# Altium project SpaceLocator.PrjPCB
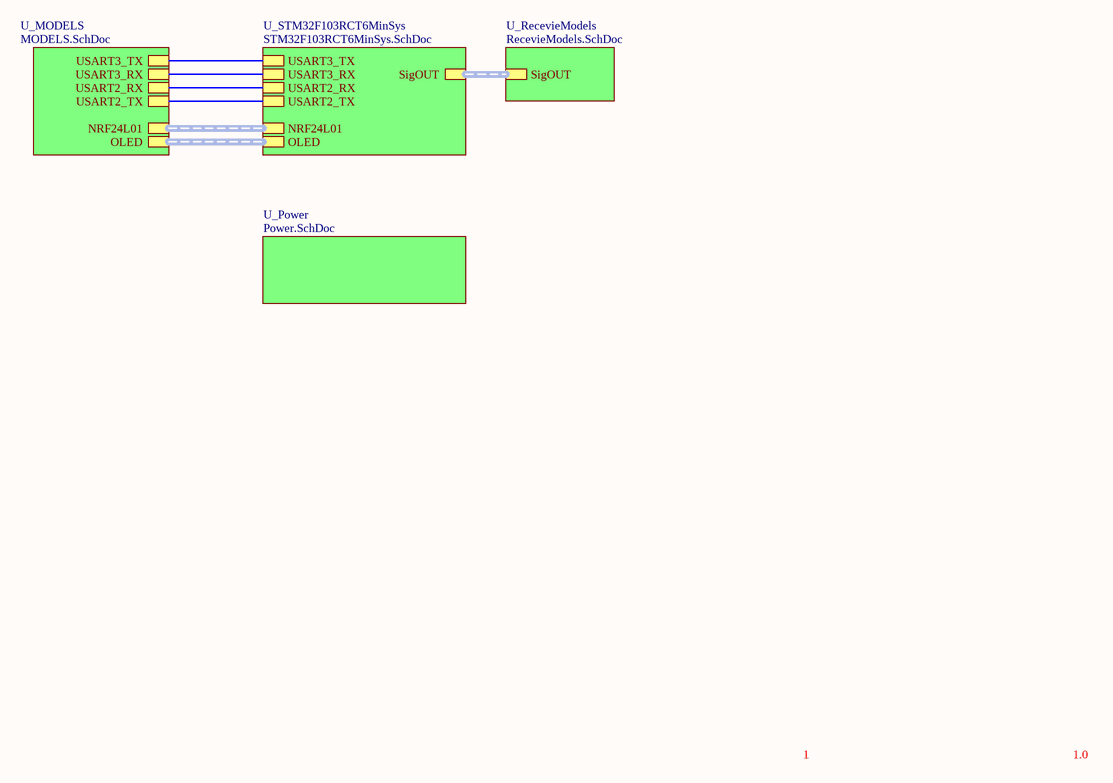
[diagram p0: MAIN.SchDoc]
5 sheets, 79 parts. Net scope: hierarchical (ports join the sheet entries above them; power ports are global).
Board file: SpaceLocator.PcbDoc
Sheets:
  MAIN.SchDoc
    U_MODELS = MODELS.SchDoc
    U_Power = Power.SchDoc
    U_RecevieModels = RecevieModels.SchDoc
    U_STM32F103RCT6MinSys = STM32F103RCT6MinSys.SchDoc

## Sheet MAIN.SchDoc: SpaceLocator
size A4; Author: 罗琪; Engineer: 罗琪

### Sub-sheets
U_MODELS = MODELS.SchDoc: NRF24L01 (harness NRF24L01), USART2_TX, USART2_RX, USART3_RX, USART3_TX, OLED (harness OLED)
U_Power = Power.SchDoc: no entries
U_RecevieModels = RecevieModels.SchDoc: SigOUT (harness SigOUT)
U_STM32F103RCT6MinSys = STM32F103RCT6MinSys.SchDoc: USART2_TX, USART2_RX, USART3_RX, USART3_TX, NRF24L01 (harness NRF24L01), SigOUT (harness SigOUT), OLED (harness OLED)

### Nets
NetU3_16: sheet U_MODELS/USART2_TX, sheet U_STM32F103RCT6MinSys/USART2_TX
NetU3_17: sheet U_MODELS/USART2_RX, sheet U_STM32F103RCT6MinSys/USART2_RX
NetU3_29: sheet U_MODELS/USART3_TX, sheet U_STM32F103RCT6MinSys/USART3_TX
NetU3_30: sheet U_MODELS/USART3_RX, sheet U_STM32F103RCT6MinSys/USART3_RX

### Buses and harness runs
harness sheet U_MODELS/NRF24L01 = sheet U_STM32F103RCT6MinSys/NRF24L01
harness sheet U_MODELS/OLED = sheet U_STM32F103RCT6MinSys/OLED
harness sheet U_RecevieModels/SigOUT = sheet U_STM32F103RCT6MinSys/SigOUT

### Notes on the sheet
- 1
- 1.0

## Sheet MODELS.SchDoc
size A4
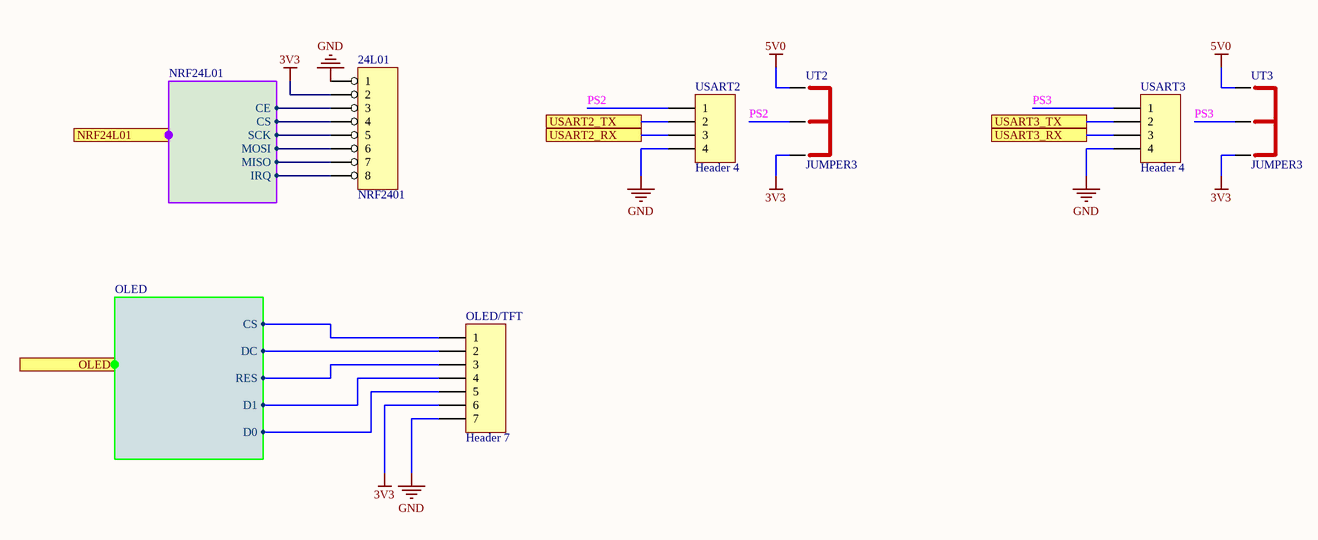
[diagram p1: MODELS.SchDoc]

### Parts
24L01  NRF2401  [HDR2X4]
OLED/TFT  Header 7  [HDR1X7]
USART2  Header 4  [HDR1X4]
USART3  Header 4  [HDR1X4]
UT2  JUMPER3  [Jumper3]
UT3  JUMPER3  [Jumper3]

### Ports
NRF24L01 (harness NRF24L01), OLED (harness OLED), USART2_RX, USART2_TX, USART3_RX, USART3_TX

### Harnesses
NRF24L01: CE, CS, SCK, MOSI, MISO, IRQ
OLED: D0, D1, RES, DC, CS

### Nets
3V3: 24L01.2 OLED/TFT.6 UT2.3 UT3.3
5V0: UT2.1 UT3.1
GND: 24L01.1 OLED/TFT.7 USART2.4 USART3.4
OLED_CS: OLED/TFT.1 ; port OLED.CS
OLED_D0: OLED/TFT.5 ; port OLED.D0
OLED_D1: OLED/TFT.4 ; port OLED.D1
OLED_DC: OLED/TFT.2 ; port OLED.DC
OLED_RES: OLED/TFT.3 ; port OLED.RES
PS2: USART2.1 UT2.2
PS3: USART3.1 UT3.2
Net24L01_3: 24L01.3 ; port NRF24L01.CE
Net24L01_4: 24L01.4 ; port NRF24L01.CS
Net24L01_5: 24L01.5 ; port NRF24L01.SCK
Net24L01_6: 24L01.6 ; port NRF24L01.MOSI
Net24L01_7: 24L01.7 ; port NRF24L01.MISO
Net24L01_8: 24L01.8 ; port NRF24L01.IRQ
NetU3_16: USART2.2 ; port USART2_TX
NetU3_17: USART2.3 ; port USART2_RX
NetU3_29: USART3.2 ; port USART3_TX
NetU3_30: USART3.3 ; port USART3_RX

### Library data of the parts
24L01 = HEADER 8: 8 Pin Header
OLED/TFT = Header 7: Header, 7-Pin; LatestRevisionDate: 17-Jul-2002; LatestRevisionNote: Re-released for DXP Platform.; Publisher: Altium Limited
USART2 USART3 = Header 4: Header, 4-Pin; LatestRevisionDate: 17-Jul-2002; LatestRevisionNote: Re-released for DXP Platform.; Publisher: Altium Limited
UT2 UT3 = JUMPER3: Jumper

## Sheet Power.SchDoc
size A4
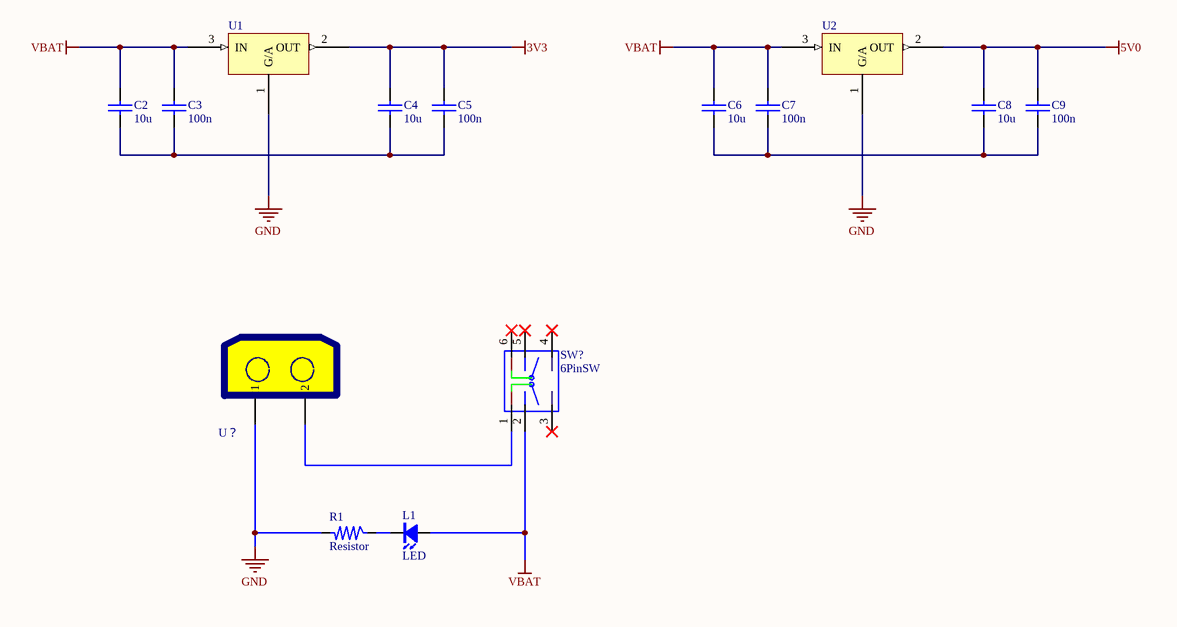
[diagram p2: Power.SchDoc]

### Parts
C2  10u  [C0805]
C3  100n  [C0603]
C4  10u  [C0805]
C5  100n  [C0603]
C6  10u  [C0805]
C7  100n  [C0603]
C8  10u  [C0805]
C9  100n  [C0603]
L1  LED  [LED0805TB]
R1  Resistor  [R0805]
SW?  6PinSW  [SW-7X7]
U1  AMS1117-XX  [SOT223]  (value not drawn)
U2  AMS1117-XX  [SOT223]  (value not drawn)
U？  P  [2脚接头]  (value not drawn)

### Nets
3V3: C4.1 C5.1 U1.2(OUT)
5V0: C8.1 C9.1 U2.2(OUT)
GND: R1.1 U1.1(G/A) U2.1(G/A) U？.1
VBAT: C2.1 C3.1 C6.1 C7.1 L1.1(A) SW?.2 U1.3(IN) U2.3(IN)
NetC2_2: C2.2 C3.2 C4.2 C5.2
NetC6_2: C6.2 C7.2 C8.2 C9.2
NetL1_2: L1.2(K) R1.2
NetSW?_1: SW?.1 U？.2

Not connected (* = marked no-connect by the designer): SW? 3(5)* 4(6)* 5(7)* 6(8)*

### Notes on the sheet
- Title
- Size:
- Date:
- A4
- Number:
- Time:
- Revision:
- Sheet
- of
- File:

### Library data of the parts
C2-C9 = Capacitor: 电容
R1 = Resistor: 电阻
U1 U2 = AMS1117-XX: 稳压芯片
U？ = 2脚接头

## Sheet RecevieModels.SchDoc
size A4
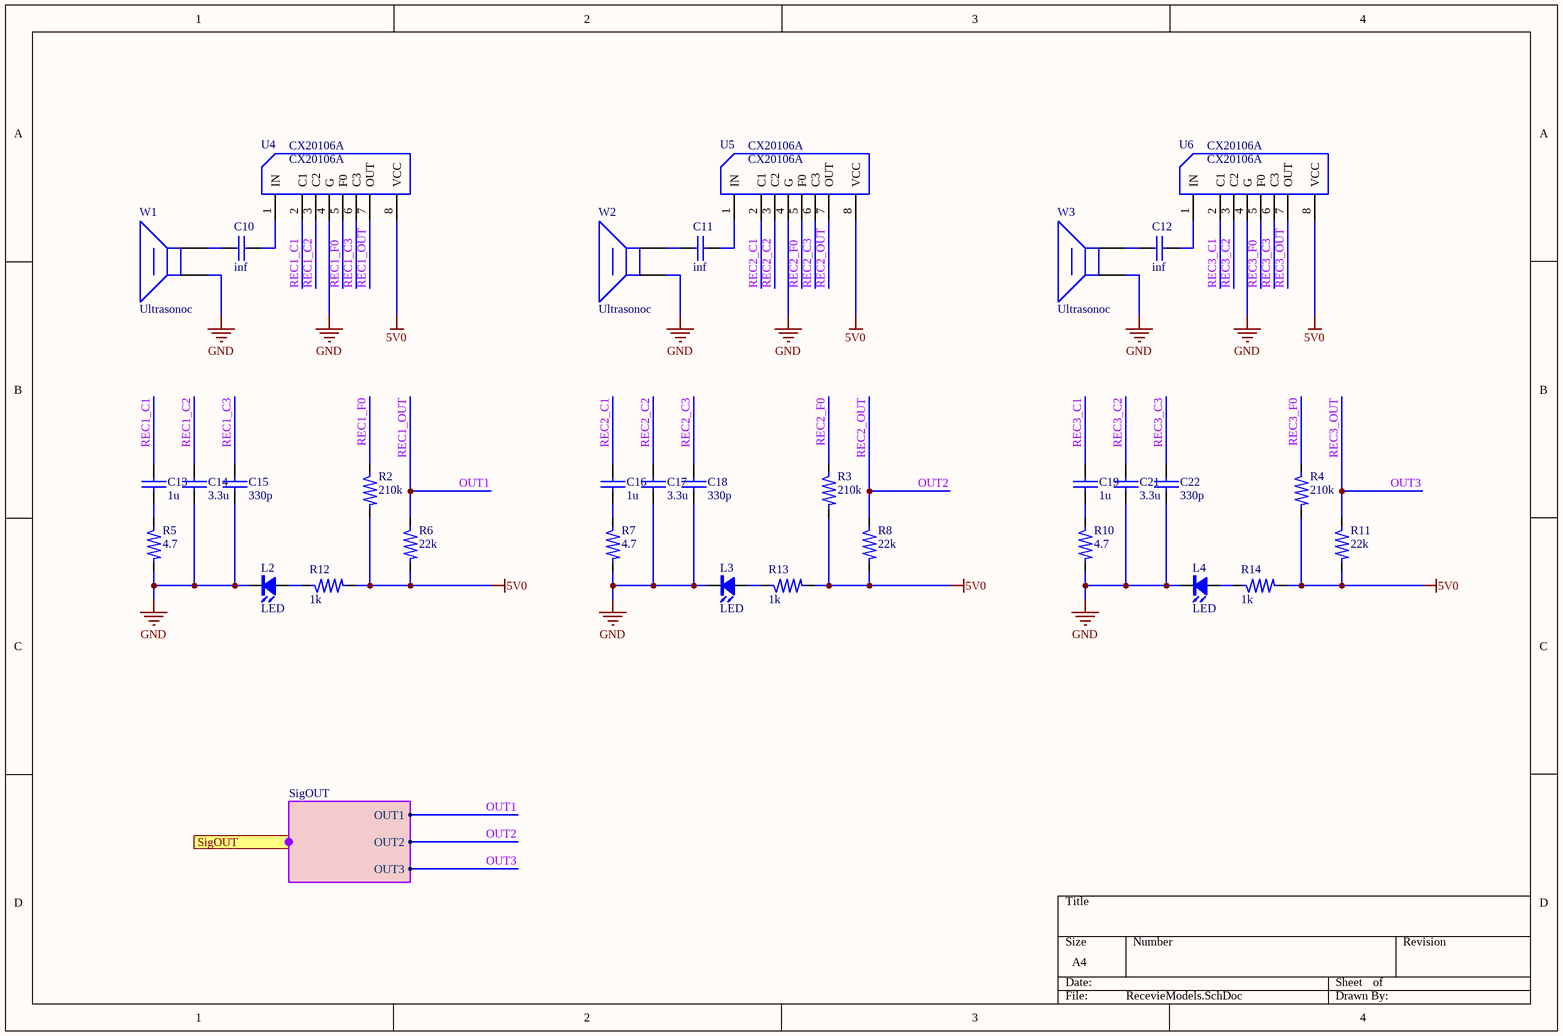
[diagram p3: RecevieModels.SchDoc]

### Parts
C10  inf  [C0603]
C11  inf  [C0603]
C12  inf  [C0603]
C13  1u  [C0603]
C14  3.3u  [C0603]
C15  330p  [C0603]
C16  1u  [C0603]
C17  3.3u  [C0603]
C18  330p  [C0603]
C19  1u  [C0603]
C21  3.3u  [C0603]
C22  330p  [C0603]
L2  LED  [LED0805TB]
L3  LED  [LED0805TB]
L4  LED  [LED0805TB]
R2  210k  [R0603]
R3  210k  [R0603]
R4  210k  [R0603]
R5  4.7  [R0603]
R6  22k  [R0603]
R7  4.7  [R0603]
R8  22k  [R0603]
R10  4.7  [R0603]
R11  22k  [R0603]
R12  1k  [R0603]
R13  1k  [R0603]
R14  1k  [R0603]
U4  CX20106A  [8Pin_100mil]
U5  CX20106A  [8Pin_100mil]
U6  CX20106A  [8Pin_100mil]
W1  Ultrasonoc  [Circle_1cm]
W2  Ultrasonoc  [Circle_1cm]
W3  Ultrasonoc  [Circle_1cm]

### Ports
SigOUT (harness SigOUT)

### Harnesses
SigOUT: OUT1, OUT2, OUT3

### Nets
5V0: R2.1 R3.1 R4.1 R6.1 R8.1 R11.1 R12.1 R13.1 R14.1 U4.8(VCC) U5.8(VCC) U6.8(VCC)
GND: C14.2 C15.2 C17.2 C18.2 C21.2 C22.2 L2.2(K) L3.2(K) L4.2(K) R5.1 R7.1 R10.1 U4.4(G) U5.4(G) U6.4(G) W1.1 W2.1 W3.1
OUT1: R6.2 U4.7(OUT) ; port SigOUT.OUT1  [also labelled REC1_OUT]  [project net EXTI0]
OUT2: R8.2 U5.7(OUT) ; port SigOUT.OUT2  [also labelled REC2_OUT]  [project net EXTI1]
OUT3: R11.2 U6.7(OUT) ; port SigOUT.OUT3  [also labelled REC3_OUT]  [project net EXTI2]
REC1_C1: C13.1 U4.2(C1)
REC1_C2: C14.1 U4.3(C2)
REC1_C3: C15.1 U4.6(C3)
REC1_F0: R2.2 U4.5(F0)
REC2_C1: C16.1 U5.2(C1)
REC2_C2: C17.1 U5.3(C2)
REC2_C3: C18.1 U5.6(C3)
REC2_F0: R3.2 U5.5(F0)
REC3_C1: C19.1 U6.2(C1)
REC3_C2: C21.1 U6.3(C2)
REC3_C3: C22.1 U6.6(C3)
REC3_F0: R4.2 U6.5(F0)
NetC10_1: C10.1 W1.2
NetC10_2: C10.2 U4.1(IN)
NetC11_1: C11.1 W2.2
NetC11_2: C11.2 U5.1(IN)
NetC12_1: C12.1 W3.2
NetC12_2: C12.2 U6.1(IN)
NetC13_2: C13.2 R5.2
NetC16_2: C16.2 R7.2
NetC19_2: C19.2 R10.2
NetL2_1: L2.1(A) R12.2
NetL3_1: L3.1(A) R13.2
NetL4_1: L4.1(A) R14.2

### Library data of the parts
C10-C19 C21 C22 = Capacitor: 电容
R2-R8 R10-R14 = Resistor: 电阻
W1-W3 = Ultrasonic

## Sheet STM32F103RCT6MinSys.SchDoc
size A4
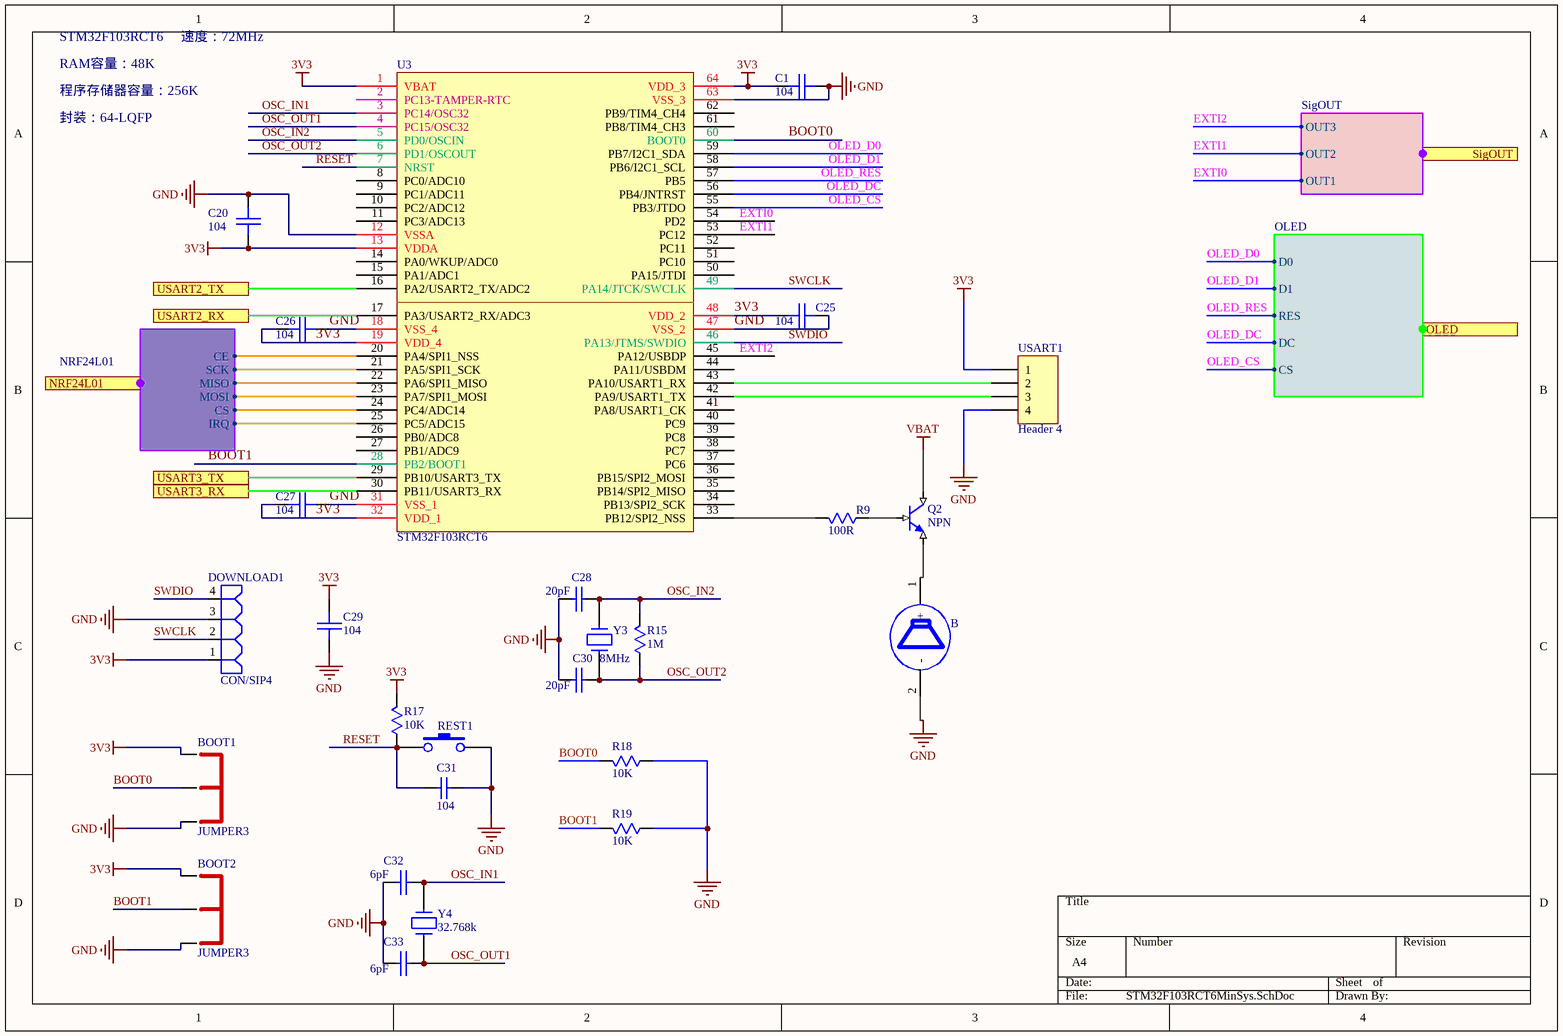
[diagram p4: STM32F103RCT6MinSys.SchDoc]

### Parts
B  BEEP  [BEEP]  (value not drawn)
BOOT1  JUMPER3  [Jumper3]
BOOT2  JUMPER3  [Jumper3]
C1  104  [C0603]
C20  104  [C0603]
C25  104  [C0603]
C26  104  [C0603]
C27  104  [C0603]
C28  20pF  [LC-0603_C]
C29  104  [C0603]
C30  20pF  [LC-0603_C]
C31  104  [LC-0603_C]
C32  6pF  [LC-0603_C]
C33  6pF  [LC-0603_C]
DOWNLOAD1  CON/SIP4  [HDR1X4]
Q2  NPN  [SOT23-3]
R9  100R  [R0603]
R15  1M  [LC-0603_R]
R17  10K  [R0603]
R18  10K  [R0603]
R19  10K  [R0603]
REST1  (no value)  [KEY-K2]
U3  STM32F103RCT6  [LC-LQFP-64_10x10x05P]
USART1  Header 4  [HDR1X4]
Y3  8MHz  [XTAL-49/S_N]
Y4  32.768k  [XTAL_2X6 卧式]

### Ports
NRF24L01 (harness NRF24L01), OLED (harness OLED), SigOUT (harness SigOUT), USART2_RX, USART2_TX, USART3_RX, USART3_TX

### Harnesses
NRF24L01: CE, SCK, MISO, MOSI, CS, IRQ
SigOUT: OUT1, OUT2, OUT3
OLED: D0, D1, RES, DC, CS

### Nets
3V3: BOOT1.1 BOOT2.1 C1.1 C20.2 C25.1 C26.1 C27.1 C29.1 DOWNLOAD1.1 R17.2 U3.1(VBAT) U3.13(VDDA) U3.19(VDD_4) U3.32(VDD_1) U3.48(VDD_2) U3.64(VDD_3) USART1.1
GND: B.2(-) BOOT1.3 BOOT2.3 C1.2 C20.1 C25.2 C26.2 C27.2 C28.1 C29.2 C30.1 C31.1 C32.1 C33.1 DOWNLOAD1.3 R18.1 R19.1 REST1.2 U3.12(VSSA) U3.18(VSS_4) U3.31(VSS_1) U3.47(VSS_2) U3.63(VSS_3) USART1.4
VBAT: Q2.3(C)
BOOT0: BOOT1.2 R18.2 U3.60(BOOT0)
BOOT1: BOOT2.2 R19.2 U3.28(PB2/BOOT1)
EXTI0: U3.54(PD2) ; port SigOUT.OUT1
EXTI1: U3.53(PC12) ; port SigOUT.OUT2
EXTI2: U3.45(PA12/USBDP) ; port SigOUT.OUT3
OLED_CS: U3.55(PB3/JTDO) ; port OLED.CS
OLED_D0: U3.59(PB7/I2C1_SDA) ; port OLED.D0
OLED_D1: U3.58(PB6/I2C1_SCL) ; port OLED.D1
OLED_DC: U3.56(PB4/JNTRST) ; port OLED.DC
OLED_RES: U3.57(PB5) ; port OLED.RES
OSC_IN1: C32.2 U3.3(PC14/OSC32) Y4.2
OSC_IN2: C28.2 R15.2 U3.5(PD0/OSCIN) Y3.1
OSC_OUT1: C33.2 U3.4(PC15/OSC32) Y4.1
OSC_OUT2: C30.2 R15.1 U3.6(PD1/OSCOUT) Y3.2
RESET: C31.2 R17.1 REST1.1 U3.7(NRST)
SWCLK: DOWNLOAD1.2 U3.49(PA14/JTCK/SWCLK)
SWDIO: DOWNLOAD1.4 U3.46(PA13/JTMS/SWDIO)
Net24L01_3: U3.20(PA4/SPI1_NSS) ; port NRF24L01.CE
Net24L01_4: U3.24(PC4/ADC14) ; port NRF24L01.CS
Net24L01_5: U3.21(PA5/SPI1_SCK) ; port NRF24L01.SCK
Net24L01_6: U3.23(PA7/SPI1_MOSI) ; port NRF24L01.MOSI
Net24L01_7: U3.22(PA6/SPI1_MISO) ; port NRF24L01.MISO
Net24L01_8: U3.25(PC5/ADC15) ; port NRF24L01.IRQ
NetB_1: B.1(+) Q2.1(E)
NetQ2_2: Q2.2(B) R9.1
NetR9_2: R9.2 U3.33(PB12/SPI2_NSS)
NetU3_16: U3.16(PA2/USART2_TX/ADC2) ; port USART2_TX
NetU3_17: U3.17(PA3/USART2_RX/ADC3) ; port USART2_RX
NetU3_29: U3.29(PB10/USART3_TX) ; port USART3_TX
NetU3_30: U3.30(PB11/USART3_RX) ; port USART3_RX
NetU3_42: U3.42(PA9/USART1_TX) USART1.3
NetU3_43: U3.43(PA10/USART1_RX) USART1.2

Not connected (* = marked no-connect by the designer): U3 2(PC13-TAMPER-RTC) 8(PC0/ADC10) 9(PC1/ADC11) 10(PC2/ADC12) 11(PC3/ADC13) 14(PA0/WKUP/ADC0) 15(PA1/ADC1) 26(PB0/ADC8) 27(PB1/ADC9) 34(PB13/SPI2_SCK) 35(PB14/SPI2_MISO) 36(PB15/SPI2_MOSI) 37(PC6) 38(PC7) 39(PC8) 40(PC9) 41(PA8/USART1_CK) 44(PA11/USBDM) 50(PA15/JTDI) 51(PC10) 52(PC11) 61(PB8/TIM4_CH3) 62(PB9/TIM4_CH4)

### Notes on the sheet
- STM32F103RCT6
- 速度：72MHz
- 程序存储器容量：256K
- RAM容量：48K
- 封装：64-LQFP

### Library data of the parts
B = 蜂鸣器
BOOT1 BOOT2 = JUMPER3: Jumper
C1 C20 C25-C27 C29 = CAP
C28 C30 = CAP: CAP CHIP 20P 50V(+-5% C0G 0603); Value: 20pF
C31 = CAP: GRM39 X7R102K50PT; Value: 100pF; Published: 8-Jun-2000; Revision: July-2002: Re-released for DXP Platform.; Publisher: Altium Limited; REF: GRM39 X7R102K50PT
C32 C33 = CAP: CAP CHIP 20P 50V(+-5% C0G 0603); Value: 20pF
Q2 = NPN: triode
R9 R15 R17-R19 = RES
REST1 = SW-PB
U3 = STM32F103RBT6
USART1 = Header 4: Header, 4-Pin; LatestRevisionDate: 17-Jul-2002; LatestRevisionNote: Re-released for DXP Platform.; Publisher: Altium Limited
Y3 Y4 = CRYSTAL: Crystal 8MHz PLUG; Value: 8MHz

## Nets that join several sheets
3V3: MODELS (24L01.2 OLED/TFT.6 UT2.3 UT3.3), Power (C4.1 C5.1 U1.2), STM32F103RCT6MinSys (17 pins)
5V0: MODELS (UT2.1 UT3.1), Power (C8.1 C9.1 U2.2), RecevieModels (12 pins)
GND: MODELS (24L01.1 OLED/TFT.7 USART2.4 USART3.4), Power (R1.1 U1.1 U2.1 U？.1), RecevieModels (18 pins), STM32F103RCT6MinSys (24 pins)
VBAT: Power (8 pins), STM32F103RCT6MinSys (Q2.3)
EXTI0: RecevieModels (R6.2 U4.7), STM32F103RCT6MinSys (U3.54)
EXTI1: RecevieModels (R8.2 U5.7), STM32F103RCT6MinSys (U3.53)
EXTI2: RecevieModels (R11.2 U6.7), STM32F103RCT6MinSys (U3.45)
Net24L01_3: MODELS (24L01.3), STM32F103RCT6MinSys (U3.20)
Net24L01_4: MODELS (24L01.4), STM32F103RCT6MinSys (U3.24)
Net24L01_5: MODELS (24L01.5), STM32F103RCT6MinSys (U3.21)
Net24L01_6: MODELS (24L01.6), STM32F103RCT6MinSys (U3.23)
Net24L01_7: MODELS (24L01.7), STM32F103RCT6MinSys (U3.22)
Net24L01_8: MODELS (24L01.8), STM32F103RCT6MinSys (U3.25)
NetU3_16: MODELS (USART2.2), STM32F103RCT6MinSys (U3.16)
NetU3_17: MODELS (USART2.3), STM32F103RCT6MinSys (U3.17)
NetU3_29: MODELS (USART3.2), STM32F103RCT6MinSys (U3.29)
NetU3_30: MODELS (USART3.3), STM32F103RCT6MinSys (U3.30)
OLED_CS: MODELS (OLED/TFT.1), STM32F103RCT6MinSys (U3.55)
OLED_D0: MODELS (OLED/TFT.5), STM32F103RCT6MinSys (U3.59)
OLED_D1: MODELS (OLED/TFT.4), STM32F103RCT6MinSys (U3.58)
OLED_DC: MODELS (OLED/TFT.2), STM32F103RCT6MinSys (U3.56)
OLED_RES: MODELS (OLED/TFT.3), STM32F103RCT6MinSys (U3.57)